# Altium schematic sheet PM12_ATxmega128.SchDoc: FIT_PM12 board
size 420 x 297 mm; CheckedBy: G.Kasprowicz; Author: INR Moscow; CompanyName: WUT ISE; DrawnBy: M.Podgórski; Organization: WUT ISE; Address1: PW ISE; Address2: Nowowiejska 15/19 00-665 Warsaw; Address3: gkasprow@gmail.com; DocumentNumber: 21; Revision: 2; SheetNumber: 21; SheetTotal: 21; ModifiedBy: -; CheckedDate: -; Title2: MCU; DivGrp: WUT ISE; Designer: INR RAS; ModifiedDate: -; ProjectName: Sensor Box
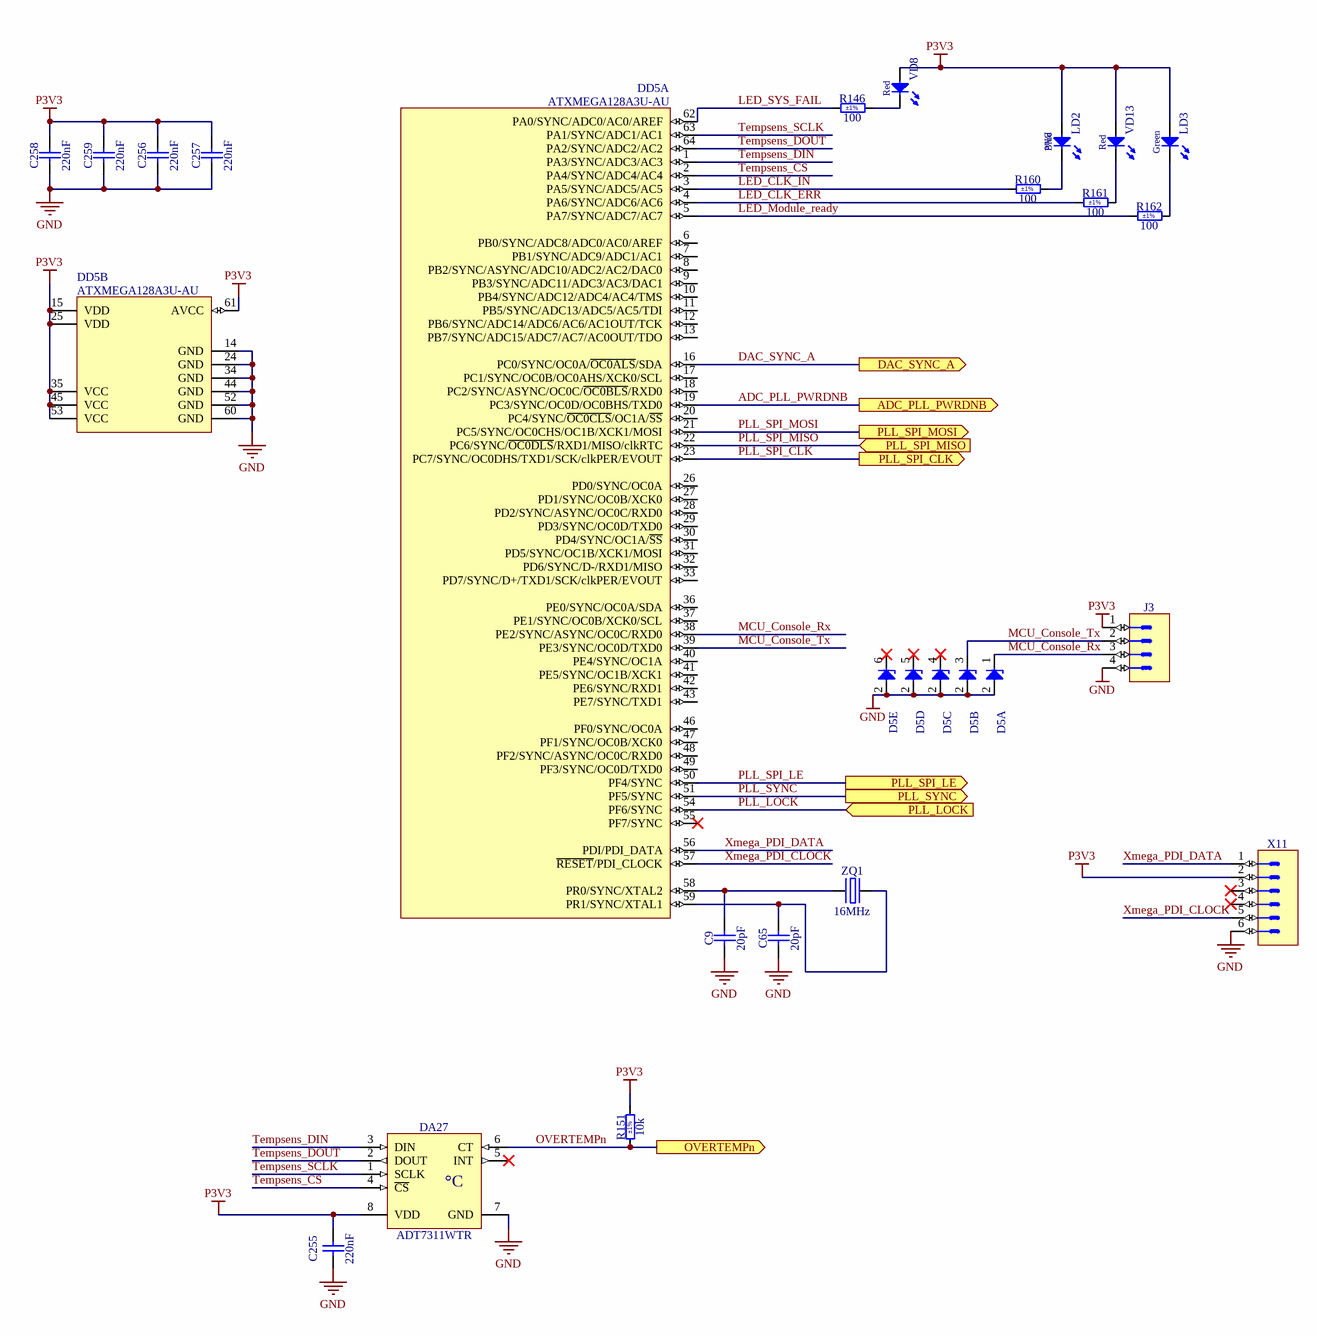
[diagram p0: PM12_ATxmega128.SchDoc]

## Parts
C9  20pF  [CAPC2012X135N]
C65  20pF  [CAPC2012X135N]
C255  220nF  [CAPC2012X135N]
C256  220nF  [CAPC2012X135N]
C257  220nF  [CAPC2012X135N]
C258  220nF  [CAPC2012X135N]
C259  220nF  [CAPC2012X135N]
D5  PESD3V3L5UY  [SOT65P210X110-6N]  (value not drawn)  (parts A,B,C,D,E of 5)
DA27  ADT7311WTR  [SOIC127P600X175-8N]
DD5  ATXMEGA128A3U-AU  [QFP80P1600X1600X120-64N]  (parts A,B of 2)
J3  Header 4  [SAMTEC_TSW-104-07-L-S-LL]  (value not drawn)
LD2  Blue  [LED_OSRAM_LB Q39G]
LD3  Green  [LED_KINGBRIGHT_KPH-1608CGCK]
R146  100  Tolerance: ±1%  [RESC1608X55N]
R151  10k  Tolerance: ±1%  [RESC1608X55N]
R160  100  Tolerance: ±1%  [RESC1608X55N]
R161  100  Tolerance: ±1%  [RESC1608X55N]
R162  100  Tolerance: ±1%  [RESC1608X55N]
VD8  Red  [LED_KINGBRIGHT_KPT-2012SURCK]
VD13  Red  [LED_KINGBRIGHT_KPT-2012SURCK]
X11  (no value)  [CONNFLY_DS1013-06SSIB1-B-0]
ZQ1  16MHz  [XTAL_ABRACON_ABL]

## Ports
ADC_PLL_PWRDNB (out), DAC_SYNC_A (out), OVERTEMPn (out), PLL_LOCK (in), PLL_SPI_CLK (out), PLL_SPI_LE (out), PLL_SPI_MISO (in), PLL_SPI_MOSI (out), PLL_SYNC (out)

## Nets
GND: C9.1 C65.1 C255.1 C256.1 C257.1 C258.1 C259.1 D5.2(A) DA27.7(GND) DD5.14(GND) DD5.24(GND) DD5.34(GND) DD5.44(GND) DD5.52(GND) DD5.60(GND) J3.4 X11.6
P3V3: C255.2 C256.2 C257.2 C258.2 C259.2 DA27.8(VDD) DD5.15(VDD) DD5.25(VDD) DD5.35(VCC) DD5.45(VCC) DD5.53(VCC) DD5.61(AVCC) J3.1 LD2.2(A) LD3.2(A) R151.2 VD8.2(A) VD13.2(A) X11.2
ADC_PLL_PWRDNB: DD5.19(PC3/SYNC/OC0D/OC0BHS/TXD0) ; port ADC_PLL_PWRDNB
DAC_SYNC_A: DD5.16(PC0/SYNC/OC0A/~{OC0ALS}/SDA) ; port DAC_SYNC_A
LED_CLK_ERR: DD5.4(PA6/SYNC/ADC6/AC6) R161.1
LED_CLK_IN: DD5.3(PA5/SYNC/ADC5/AC5) R160.1
LED_Module_ready: DD5.5(PA7/SYNC/ADC7/AC7) R162.1
LED_SYS_FAIL: DD5.62(PA0/SYNC/ADC0/AC0/AREF) R146.1
MCU_Console_Rx: D5.1(C) DD5.38(PE2/SYNC/ASYNC/OC0C/RXD0) J3.3
MCU_Console_Tx: D5.3(C) DD5.39(PE3/SYNC/OC0D/TXD0) J3.2
OVERTEMPn: DA27.6(CT) R151.1 ; port OVERTEMPn
PLL_LOCK: DD5.54(PF6/SYNC) ; port PLL_LOCK
PLL_SPI_CLK: DD5.23(PC7/SYNC/OC0DHS/TXD1/SCK/clkPER/EVOUT) ; port PLL_SPI_CLK
PLL_SPI_LE: DD5.50(PF4/SYNC) ; port PLL_SPI_LE
PLL_SPI_MISO: DD5.22(PC6/SYNC/~{OC0DLS}/RXD1/MISO/clkRTC) ; port PLL_SPI_MISO
PLL_SPI_MOSI: DD5.21(PC5/SYNC/OC0CHS/OC1B/XCK1/MOSI) ; port PLL_SPI_MOSI
PLL_SYNC: DD5.51(PF5/SYNC) ; port PLL_SYNC
Tempsens_CS: DA27.4(~{CS}) DD5.2(PA4/SYNC/ADC4/AC4)
Tempsens_DIN: DA27.3(DIN) DD5.1(PA3/SYNC/ADC3/AC3)
Tempsens_DOUT: DA27.2(DOUT) DD5.64(PA2/SYNC/ADC2/AC2)
Tempsens_SCLK: DA27.1(SCLK) DD5.63(PA1/SYNC/ADC1/AC1)
Xmega_PDI_CLOCK: DD5.57(~{RESET}/PDI_CLOCK) X11.5
Xmega_PDI_DATA: DD5.56(PDI/PDI_DATA) X11.1
NetC9_2: C9.2 DD5.58(PR0/SYNC/XTAL2) ZQ1.1(OSC1)
NetC65_2: C65.2 DD5.59(PR1/SYNC/XTAL1) ZQ1.2(OSC2)
NetLD2_1: LD2.1(C) R160.2
NetLD3_1: LD3.1(C) R162.2
NetR146_2: R146.2 VD8.1(C)
NetR161_2: R161.2 VD13.1(C)

Not connected (* = marked no-connect by the designer): D5 4(C)* 5(C)* 6(C)*; DA27 5(INT)*; DD5 6(PB0/SYNC/ADC8/ADC0/AC0/AREF) 7(PB1/SYNC/ADC9/ADC1/AC1) 8(PB2/SYNC/ASYNC/ADC10/ADC2/AC2/DAC0) 9(PB3/SYNC/ADC11/ADC3/AC3/DAC1) 10(PB4/SYNC/ADC12/ADC4/AC4/TMS) 11(PB5/SYNC/ADC13/ADC5/AC5/TDI) 12(PB6/SYNC/ADC14/ADC6/AC6/AC1OUT/TCK) 13(PB7/SYNC/ADC15/ADC7/AC7/AC0OUT/TDO) 17(PC1/SYNC/OC0B/OC0AHS/XCK0/SCL) 18(PC2/SYNC/ASYNC/OC0C/~{OC0BLS}/RXD0) 20(PC4/SYNC/~{OC0CLS}/OC1A/~{SS}) 26(PD0/SYNC/OC0A) 27(PD1/SYNC/OC0B/XCK0) 28(PD2/SYNC/ASYNC/OC0C/RXD0) 29(PD3/SYNC/OC0D/TXD0) 30(PD4/SYNC/OC1A/~{SS}) 31(PD5/SYNC/OC1B/XCK1/MOSI) 32(PD6/SYNC/D-/RXD1/MISO) 33(PD7/SYNC/D+/TXD1/SCK/clkPER/EVOUT) 36(PE0/SYNC/OC0A/SDA) 37(PE1/SYNC/OC0B/XCK0/SCL) 40(PE4/SYNC/OC1A) 41(PE5/SYNC/OC1B/XCK1) 42(PE6/SYNC/RXD1) 43(PE7/SYNC/TXD1) 46(PF0/SYNC/OC0A) 47(PF1/SYNC/OC0B/XCK0) 48(PF2/SYNC/ASYNC/OC0C/RXD0) 49(PF3/SYNC/OC0D/TXD0) 55(PF7/SYNC)*; X11 3* 4*

## Notes on the sheet
- Project/Equipment
- Document
- Designer
- Drawn by
- Check.by
- Copyright WUT ISE 2024.
  This documentation describes Open Hardware and is licensed under the CERN OHL v.2. You may redistribute and modify this documentation under the terms of the CERN OHL v.2. (http://ohwr.org/CERNOHL). This documentation is distributed WITHOUT ANY EXPRESS OR IMPLIED WARRANTY, INCLUDING OF MERCHANTABILITY, SATISFACTORY QUALITY AND FITNESS FOR A PARTICULAR PURPOSE. Please see the CERN OHL v.2 for applicable conditions.
- Contact
- File
- Last Mod.
- Print Date
- Sheet
- Size
- A3
- of
- Rev
- (in symbol ADT7311WTR) °C

## Library data of the parts
C9 C65 = CC0805_20PF_50V_2%_C0G: Non-polarised capacitor; Part Description: SMD Multilayer Chip Ceramic Capacitor; Manufacturer: GENERIC; Manufacturer1 Part Number: CC0805GRNPO9BN200; Voltage: 50V; TC: C0G/NP0; Tolerance: ±2%; Part Number: CC0805_20PF_50V_2%_C0G; Component Kind: Standard; Component Type: Standard; Pin Count: 2; Value: 20pF; Status: None; Manufacturer Part Number: CC0805_20PF_50V_2%_C0G; Case: 0805; Mounted: Yes; Socket: No; SMD: Yes; Sense: No; Manufacturer1 Example: YAGEO PHYCOMP; Manufacturer1 ComponentHeight: 1.45mm; HelpURL: \\cern.ch\dfs\Applications\Altium\Datasheets\CC0805_NP0_YAGEO.pdf; Author: CERN DEM HF; CreateDate: 07.05.2024; LatestRevisionDate: 07.05.2024
C255-C259 = CC0805_220NF_50V_10%_X7R: Non-polarised capacitor; Part Description: SMD Multilayer Chip Ceramic Capacitor; Manufacturer: GENERIC; Manufacturer1 Part Number: GRM21BR71H224KA01L; Voltage: 50V; TC: X7R; Tolerance: ±10%; Part Number: CC0805_220NF_50V_10%_X7R; Component Kind: Standard; Component Type: Standard; Pin Count: 2; Value: 220nF; Status: Preferred; Manufacturer Part Number: CC0805_220NF_50V_10%_X7R; Case: 0805; Mounted: Yes; Socket: No; SMD: Yes; Sense: No; Manufacturer1 Example: MURATA; Manufacturer1 ComponentHeight: 1.35mm; HelpURL: \\cern.ch\dfs\Applications\Altium\Datasheets\CC0805_X7R_MURATA.pdf; Author: CERN DEM JLC; CreateDate: 03.12.2007; LatestRevisionDate: 03.12.2007
D5 = PESD3V3L5UY: Fivefold ESD Protection Diode Arrays; Part Description: Fivefold ESD Protection Diode Arrays (30kV); Manufacturer: NEXPERIA; Voltage: 3.3V; Power: 200W; PressFit: No; Bonding: No; Part Number: PESD3V3L5UY; Component Kind: Standard; Component Type: Standard; Device: PESD3V3L5UY; PackageDescription: SOT363, SC-88, 0.65mm Pitch; 6 Pin, 1.25mm W X 2.00mm L X 1.10mm H body, IPC Medium Density; Manufacturer Part Number: PESD3V3L5UY; Pin Count: 6; Case: SOT363; Mounted: Yes; Socket: No; SMD: Yes; Sense: No; ComponentHeight: 1.1mm; HelpURL: \\cern.ch\dfs\Applications\Altium\Datasheets\PESD3V3L5UY.pdf; Author: CERN DEM WB; CreateDate: 05/07/2021; LatestRevisionDate: 05/07/2021
DA27 = ADT7311WTR: ±0.5°C Accurate, 16-Bit Digital SPI Temperature Sensor; Manufacturer: ANALOG DEVICES; PressFit: No; Bonding: No; Part Number: ADT7311WTR; Component Kind: Standard; Component Type: Standard; Device: ADT7311WTR; PackageDescription: SOIC 8, Pitch 1.27mm - Body 4x5mm, IPC Medium Density; Part Description: ±0.5°C Accurate, 16-Bit Digital SPI Temperature Sensor; Manufacturer Part Number: ADT7311WTR; Pin Count: 8; Case: SOIC8; Mounted: Yes; Socket: No; SMD: Yes; Sense: No; ComponentHeight: 1.75mm; HelpURL: \\cern.ch\dfs\Applications\Altium\Datasheets\ADT7311WTR.pdf; Author: CERN DEM HF; CreateDate: 24.05.2024; LatestRevisionDate: 24.05.2024
DD5 = ATXMEGA128A3U-AU: 8/16-bit XMEGA A3BU 32MHz Microcontroller With 256KBytes of in-System Self-Programmable Flash; Part Description: 8/16-bit XMEGA A3U 32MHz Microcontroller with 128KBytes of in-System Self-Programmable Flash; Manufacturer: MICROCHIP TECHNOLOGY; PressFit: No; Bonding: No; Part Number: ATXMEGA128A3U-AU; Component Kind: Standard; Component Type: Standard; Device: ATXMEGA128A3U-AU; PackageDescription: QFP, 0.80mm Pitch, Square; 64 Pin, 14.00mm L X 14.00mm W X 1.20mm H body, IPC Medium Density; Manufacturer Part Number: ATXMEGA128A3U-AU; Pin Count: 64; Case: QFP64; Mounted: Yes; Socket: No; SMD: Yes; Sense: No; ComponentHeight: 1.2mm; HelpURL: \\cern.ch\dfs\Applications\Altium\Datasheets\ATXMEGA128A3U-AU.pdf; Author: CERN DEM HF; CreateDate: 24.05.2024; LatestRevisionDate: 24.05.2024
J3 = SAMTEC_TSW-104-07-L-S-LL: Connector 4 Male; Part Description: 4 Contacts, Pitch 2.54mm, Single Row  Through Mount Straigh Header (Post Lead 5.84mm, Tail Lead 2.54mm, Insulator 2.54mm); Manufacturer: SAMTEC; PressFit: No; Part Number: SAMTEC_TSW-104-07-L-S-LL; Component Kind: Standard; Component Type: Standard; Pin Count: 4; Family: Header 4; Mounted: Yes; Socket: No; SMD: No; Sense: No; Status: None; Manufacturer Part Number: TSW-104-07-L-S-LL; ComponentHeight: 8.38mm; HelpURL: \\cern.ch\dfs\Applications\Altium\Datasheets\SAMTEC_TSW-104-07-L-S-LL.pdf; Author: CERN DEM MR; CreateDate: 07.12.2016; LatestRevisionDate: 07.12.2016
LD2 = LED_OSRAM_LB Q39G: LED Blue 1C 2A; Part Description: CHIPLED Blue LED (0603 Case); Manufacturer: OSRAM; Manufacturer Part Number: LB Q39G; PressFit: No; Bonding: No; Part Number: LED_OSRAM_LB Q39G; Component Kind: Standard; Component Type: Standard; Color: Blue; PackageDescription: Blue Chip LED, 2-Leads, Body 1.6x0.8mm , IPC Medium Density; Pin Count: 2; Case: 0603; Mounted: Yes; Socket: No; SMD: Yes; Sense: No; ComponentHeight: 0.35mm; HelpURL: \\cern.ch\dfs\Applications\Altium\Datasheets\LED_OSRAM_LB Q39G.pdf; Author: CERN DEM HF; CreateDate: 16.08.2023; LatestRevisionDate: 16.08.2023
LD3 = LED_KINGBRIGHT_KPH-1608CGCK: LED Green 1C 2A; Part Description: SMD Green LED, Case 1.6mmX0.8mm(0603), 0.65mm Thickness; PressFit: No; Bonding: No; Part Number: LED_KINGBRIGHT_KPH-1608CGCK; Component Kind: Standard; Component Type: Standard; Color: Green; PackageDescription: SMT Green LED, Case 0603, Body L 1.6 x W 0.8mm H 0.65mm; Manufacturer: KINGBRIGHT; Manufacturer Part Number: KPH-1608CGCK; Pin Count: 2; Case: 0603; Mounted: Yes; Socket: No; SMD: Yes; Sense: No; ComponentHeight: 0.65mm; HelpURL: \\cern.ch\dfs\Applications\Altium\Datasheets\LED_KINGBRIGHT_KPH-1608CGCK.pdf; Author: CERN DEM JLC; CreateDate: 03.07.2017; LatestRevisionDate: 03.07.2017
R146 R160-R162 = R0603_100R_1%_0.1W_100PPM: Resistor - 1%; Part Description: General Purpose Thick Film Chip Resistor; Manufacturer: GENERIC; Manufacturer1 Part Number: NRC06F4700TRF; Power: 0.1W; TC: ±100ppm/°C; PressFit: No; Part Number: R0603_100R_1%_0.1W_100PPM; Component Kind: Standard; Component Type: Standard; Pin Count: 2; Value: 100; Status: Preferred; Manufacturer Part Number: R0603_100R_1%_0.1W_100PPM; Case: 0603; Mounted: Yes; Sense: No; Socket: No; SMD: Yes; Manufacturer1 Example: NIC COMPONENT; Manufacturer1 ComponentHeight: 0.55mm; HelpURL: \\cern.ch\dfs\Applications\Altium\Datasheets\R0603_NIC_NRC.pdf; Author: CERN DEM JLC; CreateDate: 03.12.2007; LatestRevisionDate: 13.03.2008
R151 = R0603_10K_1%_0.1W_100PPM: Resistor - 1%; Part Description: General Purpose Thick Film Chip Resistor; Manufacturer: GENERIC; Manufacturer1 Part Number: NRC06F1002TRF; Power: 0.1W; TC: ±100ppm/°C; PressFit: No; Part Number: R0603_10K_1%_0.1W_100PPM; Component Kind: Standard; Component Type: Standard; Pin Count: 2; Value: 10k; Status: Preferred; Manufacturer Part Number: R0603_10K_1%_0.1W_100PPM; Case: 0603; Mounted: Yes; Sense: No; Socket: No; SMD: Yes; Manufacturer1 Example: NIC COMPONENT; Manufacturer1 ComponentHeight: 0.55mm; HelpURL: \\cern.ch\dfs\Applications\Altium\Datasheets\R0603_NIC_NRC.pdf; Author: CERN DEM JLC; CreateDate: 03.12.2007; LatestRevisionDate: 13.03.2008
VD8 VD13 = LED_KINGBRIGHT_KPT-2012SURCK: LED Red 1C 2A; Part Description: 2.0X1.25mm, SMD Hyper Red Chip LED Lamp, KPT-2012 Series; PressFit: No; Bonding: No; Part Number: LED_KINGBRIGHT_KPT-2012SURCK; Component Kind: Standard; Component Type: Standard; Color: Red; PackageDescription: SMT Hyper Red LED, Case 2012, Body L 2.00mm X  W 1.25mm X H 0.75mm; Manufacturer: KINGBRIGHT; Manufacturer Part Number: KPT-2012SURCK; Pin Count: 2; Case: 0805; Mounted: Yes; Socket: No; SMD: Yes; Sense: No; ComponentHeight: 0.75mm; HelpURL: \\cern.ch\dfs\Applications\Altium\Datasheets\LED_KINGBRIGHT_KPT-2012SURCK.pdf; Author: CERN DEM BC; CreateDate: 06.11.2020; LatestRevisionDate: 06.11.2020
X11 = CONNFLY_DS1013-06SSIB1-B-0: Connector 6 Male; Part Description: 6 Contacts, 2.54mm Box Header V/T,R/A & SMT Type; PressFit: No; Part Number: CONNFLY_DS1013-06SSIB1-B-0; Component Kind: Standard; Component Type: Standard; Pin Count: 6; Mounted: Yes; Socket: No; SMD: No; Sense: No; Status: None; Manufacturer: CONNFLY; Manufacturer Part Number: DS1013-06SSIB1-B-0; ComponentHeight: 9.1mm; HelpURL: \\cern.ch\dfs\Applications\Altium\Datasheets\CONNFLY_DS1013.pdf; Author: CERN DEM HF; CreateDate: 30.05.2024; LatestRevisionDate: 30.05.2024
ZQ1 = XTAL_16MHZ_ABRACON_ABL-16.000MHZ-B1U: Quartz Crystal; Part Description: Tolerance: ±10ppm, Stability: ±10ppm, -20°C to +70°C, 18pF, 40 Ohms ESR, Through Mount Microprocessor Crystal, ABL Series; PressFit: No; Bonding: No; Part Number: XTAL_16MHZ_ABRACON_ABL-16.000MHZ-B1U; Component Kind: Standard; Component Type: Standard; PackageDescription: THD Crystal, Body 11.5mm L X 5.00mm W X 3.50mm H, ALB Series; Value: 16MHz; Manufacturer: ABRACON; Manufacturer Part Number: ABL-16.000MHZ-B1U; Pin Count: 2; Mounted: Yes; Socket: No; SMD: No; Sense: No; ComponentHeight: 3.5mm; HelpURL: \\cern.ch\dfs\Applications\Altium\Datasheets\XTAL_ABRACON_ABL.pdf; Author: CERN DEM HF; CreateDate: 04.06.2024; LatestRevisionDate: 04.06.2024